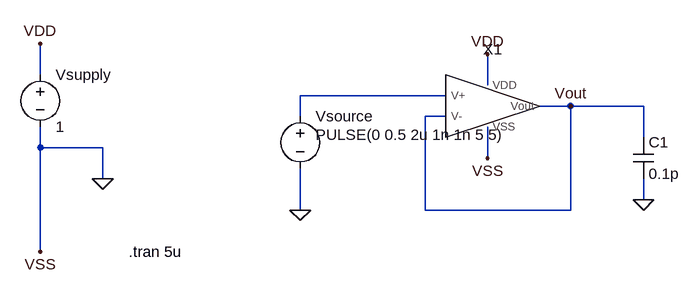
[diagram p0: schematic SIM_transient.asc]
SIM_transient.asc, the LTspice schematic file:
Version 4
SHEET 1 880 680
WIRE -400 64 -400 16
WIRE 288 80 288 32
WIRE 224 96 0 96
WIRE 416 112 368 112
WIRE 528 112 416 112
WIRE 0 128 0 96
WIRE 224 128 192 128
WIRE 528 160 528 112
WIRE -400 176 -400 144
WIRE -304 176 -400 176
WIRE 288 192 288 144
WIRE -304 224 -304 176
WIRE 528 256 528 224
WIRE 0 272 0 208
WIRE 192 272 192 128
WIRE 416 272 416 112
WIRE 416 272 192 272
WIRE -400 336 -400 176
FLAG 0 272 0
FLAG -304 224 0
FLAG 288 32 VDD
FLAG 288 192 VSS
FLAG 528 256 0
FLAG -400 16 VDD
FLAG -400 336 VSS
FLAG 416 112 Vout
SYMBOL voltage -400 48 R0
WINDOW 123 0 0 Left 0
WINDOW 39 0 0 Left 0
SYMATTR InstName Vsupply
SYMATTR Value 1
SYMBOL voltage 0 112 R0
WINDOW 3 24 44 Left 2
WINDOW 123 0 0 Left 0
WINDOW 39 0 0 Left 0
SYMATTR Value PULSE(0 0.5 2u 1n 1n 5 5)
SYMATTR InstName Vsource
SYMBOL cap 512 160 R0
SYMATTR InstName C1
SYMATTR Value 0.1p
SYMBOL OpAmp_V1 288 112 R0
SYMATTR InstName X1
TEXT -264 336 Left 2 !.tran 5u

The netlist it stands for:
* SIM_transient.asc
Vsupply VDD 0 1
Vsource N001 0 PULSE(0 0.5 2u 1n 1n 5 5)
C1 Vout 0 0.1p
XX1 N001 Vout VDD 0 Vout OpAmp_V1  ; pins V+ V- VDD VSS Vout
.tran 5u
.backanno
.end